# EAGLE schematic GPS_board_sch (EAGLE 8.6.0)
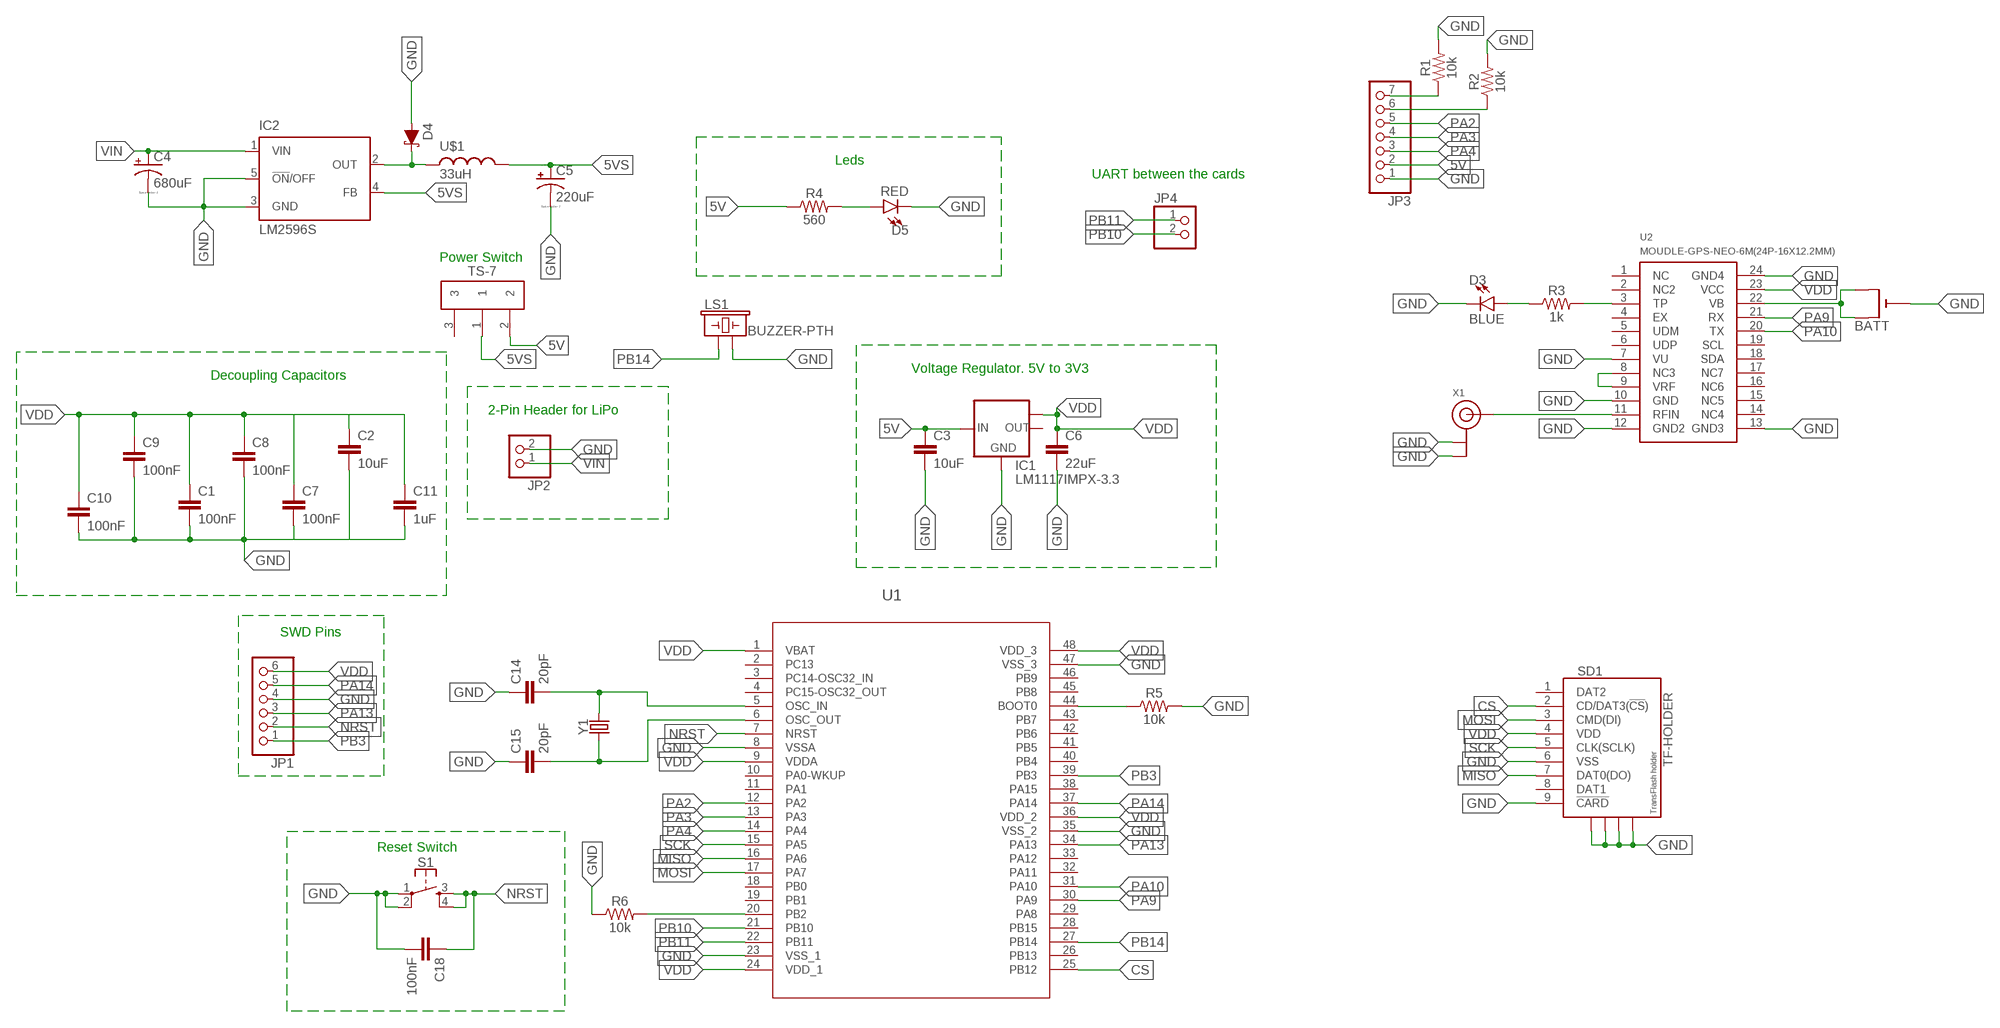
[diagram p0: schematic, sheet 1]

## Parts
BATT  CR1220SMT  [CR1220-SMD]
C1  100nF  10UF-0805-10V-10%  [0805]
C2  10uF  10UF-0805-10V-10%  [0805]
C3  10uF  10UF-0805-10V-10%  [0805]
C4  680uF  CPOL-USTT5D7  [TT5D7]
C5  220uF  CPOL-USTT5D7  [TT5D7]
C6  22uF  10UF-0805-10V-10%  [0805]
C7  100nF  10UF-0805-10V-10%  [0805]
C8  100nF  10UF-0805-10V-10%  [0805]
C9  100nF  10UF-0805-10V-10%  [0805]
C10  100nF  10UF-0805-10V-10%  [0805]
C11  1uF  10UF-0805-10V-10%  [0805]
C14  20pF  10UF-0805-10V-10%  [0805]
C15  20pF  10UF-0805-10V-10%  [0805]
C18  100nF  10UF-0805-10V-10%  [0805]
D3  BLUE  LED-BLUE1206  [LED-1206]
D4  3A/40V/500mV  DIODE-SCHOTTKY-B340A  [SMA-DIODE]
D5  RED  LED-RED1206  [LED-1206]
IC1  LM1117IMPX-3.3  [SOT223]
IC2  LM2596S  [TO263-5]
JP1  PINHD-1X6  [1X06]
JP2  PINHD-1X2  [1X02]
JP3  PINHD-1X7  [1X07]
JP4  PINHD-1X2/90  [1X02/90]
LS1  BUZZER-PTH  [BUZZER-12MM]
R1  10k  0.3OHM-0805-1/8W-1%  [0805]
R2  10k  0.3OHM-0805-1/8W-1%  [0805]
R3  1k  0.3OHM-0805-1/8W-1%  [0805]
R4  560  0.3OHM-0805-1/8W-1%  [0805]
R5  10k  0.3OHM-0805-1/8W-1%  [0805]
R6  10k  0.3OHM-0805-1/8W-1%  [0805]
S1  MOMENTARY-SWITCH-SPST-2-SMD-5.2MM  [TACTILE_SWITCH_SMD_5.2MM]
SD1  TF-HOLDER  [TF-PULL]
TS-7  TS-7  [TS7]
U1  STM32F103CXT2  [LQFP48-7X7MM]
U2  MOUDLE-GPS-NEO-6M(24P-16X12.2MM)  [GPS24P-SMD-1.1-16X12.2MM]
U$1  33uH  MSS1260  [MSS1260]
X1  ANTENNA_U.FL  [U.FL]
Y1  CRYSTALPTH-HC49US  [HC49US]

## Nets
5V: C3.1 IC1.3(IN) JP3.2 R4.1 TS-7.2
5VS: C5.+ IC2.4(FB) TS-7.1 U$1.P$1
CS: SD1.2(CD/DAT3(!CS!)) U1.25(PB12)
GND: BATT.- C1.2 C2.2 C3.2 C4.- C5.- C6.2 C7.2 C8.2 C9.2 C10.2 C11.2 C14.1 C15.1 C18.2 D3.C D4.A D5.C IC1.1(GND) IC2.3(GND) IC2.5(!ON!/OFF) JP1.4 JP2.2 JP3.1 LS1.- R1.2 R2.2 R5.2 R6.1 S1.1 S1.2 SD1.6(VSS) SD1.9(!CARD) SD1.S1 SD1.S2 SD1.S3 SD1.S4 U1.8(VSSA) U1.23(VSS_1) U1.35(VSS_2) U1.47(VSS_3) U2.7(VU) U2.10(GND) U2.12(GND2) U2.13(GND3) U2.24(GND4) X1.1(GND) X1.2(GND)
MISO: SD1.7(DAT0(DO)) U1.16(PA6)
MOSI: SD1.3(CMD(DI)) U1.17(PA7)
N$2: C14.2 U1.5(OSC_IN) Y1.2
N$3: C15.2 U1.6(OSC_OUT) Y1.1
N$7: BATT.+$1(+) BATT.+$2(+1) U2.22(VB)
N$8: U2.11(RFIN) X1.3(SIGNAL)
N$11: R5.1 U1.44(BOOT0)
N$12: R6.2 U1.20(PB2)
N$13: D4.C IC2.2(OUT) U$1.P$2
N$16: D5.A R4.2
N$18: U2.8(NC3) U2.9(VRF)
N$20: R3.2 U2.3(TP)
N$21: D3.A R3.1
N$22: JP3.7 R1.1
N$23: JP3.6 R2.1
NRST: C18.1 JP1.2 S1.3 S1.4 U1.7(NRST)
PA2: JP3.5 U1.12(PA2)
PA3: JP3.4 U1.13(PA3)
PA4: JP3.3 U1.14(PA4)
PA9: U1.30(PA9) U2.21(RX)
PA10: U1.31(PA10) U2.20(TX)
PA13: JP1.3 U1.34(PA13)
PA14: JP1.5 U1.37(PA14)
PB3: JP1.1 U1.39(PB3)
PB10: JP4.2 U1.21(PB10)
PB11: JP4.1 U1.22(PB11)
PB14: LS1.+ U1.27(PB14)
SCK: SD1.5(CLK(SCLK)) U1.15(PA5)
VDD: C1.1 C2.1 C6.1 C7.1 C8.1 C9.1 C10.1 C11.1 IC1.TAB(OUT1) JP1.6 SD1.4(VDD) U1.1(VBAT) U1.9(VDDA) U1.24(VDD_1) U1.36(VDD_2) U1.48(VDD_3) U2.23(VCC)
VIN: C4.+ IC2.1(VIN) JP2.1
Unconnected: IC1.2(OUT) SD1.1(DAT2) SD1.8(DAT1) TS-7.3 U1.2(PC13) U1.3(PC14-OSC32_IN) U1.4(PC15-OSC32_OUT) U1.10(PA0-WKUP) U1.11(PA1) U1.18(PB0) U1.19(PB1) U1.26(PB13) U1.28(PB15) U1.29(PA8) U1.32(PA11) U1.33(PA12) U1.38(PA15) U1.40(PB4) U1.41(PB5) U1.42(PB6) U1.43(PB7) U1.45(PB8) U1.46(PB9) U2.1(NC) U2.2(NC2) U2.4(EX) U2.5(UDM) U2.6(UDP) U2.14(NC4) U2.15(NC5) U2.16(NC6) U2.17(NC7) U2.18(SDA) U2.19(SCL)

## Notes on the sheet
- Leds
- UART between the cards
- Power Switch
- Voltage Regulator. 5V to 3V3
- Decoupling Capacitors
- 2-Pin Header for LiPo
- SWD Pins
- Reset Switch

## Library data of the parts
BATT = adafruit:CR1220: CR1216/CR1220/CR1225 12mm 3V lithium coin cell Great for battery packup. Both SMT and THM holders. Note the THM package has the ground pads on both sides of the PCB so that the masks are the same - this reduces the cost
C1 C6-C11 C14 C15 C18 = SparkFun-Capacitors:10UF: 10.0µF ceramic capacitors A capacitor is a passive two-terminal electrical component used to store electrical energy temporarily in an electric field.; PROD_ID: CAP-11330; VALUE: 10uF
C2 C3 = SparkFun-Capacitors:10UF: 10.0µF ceramic capacitors A capacitor is a passive two-terminal electrical component used to store electrical energy temporarily in an electric field.; PROD_ID: CAP-11330
C4 C5 = resistor:CPOL-US: POLARIZED CAPACITOR, American symbol
D3 = SparkFun-LED:LED-BLUE: Blue SMD LED Used in manufacturing of various products at SparkFun Packages: 0603 - SMD 0603 package [Product Link] <http://www.digikey.com/product-detail/en/SMLE12BC7TT86/511-1589-2-ND/1641808> 1206 - SMD1206 package [Product Link] <http://www.digikey.com/product-detail/en/lite-on-inc/LTST-C150TBKT/160-1643-1-ND/573584> SparkFun Products: ESP8266 Thing-Dev Board <https://www.sparkfun.com/products/13711> RedBoard <https://www.sparkfun.com/products/12757>; PROD_ID: DIO-09911
D4 = SparkFun-DiscreteSemi:DIODE-SCHOTTKY: Schottky diode A Schottky diode is a semiconductor diode which has a low forward voltage drop and a very fast switching action.; PROD_ID: DIO-09886
D5 = SparkFun-LED:LED-RED: Red SMD LED Used in manufacturing of most products at SparkFun Packages: 0603 - SMD 0603 package [Product Link] <http://docs.avagotech.com/docs/AV02-0551EN> 0603 SMART - SMD 0603 SMART package ( more efficient and expensive)[Product Link] <http://www.osram-os.com/Graphics/XPic2/00077099_0.pdf> 1206 - SMD1206 package [Product Link] <https://www.sparkfun.com/datasheets/DevTools/LilyPad/Q150OVS4.pdff> SparkFun Products: Pro Mini 328 -5V <https://www.sparkfun.com/products/821> RedBoard <https://www.sparkfun.com/products/12757> IOIO-OTG <https://www.sparkfun.com/products/13613>; PROD_ID: DIO-09912
IC1 = lm1117:LM1117IMPX-*
IC2 = national-semiconductor:LM2596: SIMPLE SWITCHER® Power Converter 150 kHz 3A Step-Down Voltage Regulator Source: http://www.national.com/ds/LM/LM2596.pdf; MF: NATIONAL SEMICONDUCTOR; MPN: LM2596S-ADJ/NOPB; OC_FARNELL: 9494367; OC_NEWARK: 41K3842
JP1 = pinhead:PINHD-1X6: PIN HEADER
JP2 JP4 = pinhead:PINHD-1X2: PIN HEADER
JP3 = pinhead:PINHD-1X7: PIN HEADER
LS1 = SparkFun-Electromechanical:BUZZER: Buzzer Small round buzzers that operate around the audible 2kHz range. You can use these as speakers to create simple music or user interfaces. Variant Overview: PTH - Mini Speaker - PC Mount 12mm 2.048kHz <https://www.sparkfun.com/products/7950> PTH_KIT - Mini Speaker - PC Mount 12mm 2.048kHz <https://www.sparkfun.com/products/7950> KIT simplifies soldering by adding stop mask to one side of the pads. PTH_NO_SILK - Mini Speaker - PC Mount 12mm 2.048kHz <https://www.sparkfun.com/products/7950> No silkscreen indicator of buzzer outline. PTH_KIT_NO_SILK - Mini Speaker - PC Mount 12mm 2.048kHz <https://www.sparkfun.com/products/7950> KIT package w/o silkscreen SMD - Buzzer Audio Magnetic (CCV-084B16) SMD buzzer used on, e.g. the LilyPad Buzzer <https://www.sparkfun.com/products/8463> and RFID USB Reader <https://www.sparkfun.com/products/9963>. SMD_KIT - Buzzer Audio Magnetic (CCV-084B16) SMD Buzzer with elongated pins to make soldering easier. Used on the SparkFun Simon Says - Surface Mount Soldering Kit <https://www.sparkfun.com/products/10935>.; PROD_ID: COMP-08253; SF_SKU: COM-07950
R1-R6 = SparkFun-Resistors:0.3OHM: 0.3Ω resistor A resistor is a passive two-terminal electrical component that implements electrical resistance as a circuit element. Resistors act to reduce current flow, and, at the same time, act to lower voltage levels within circuits. - Wikipedia; PROD_ID: RES-11622; VALUE: 0.3
S1 = SparkFun-Switches:MOMENTARY-SWITCH-SPST-2: Momentary Switch (Pushbutton) - SPST - Two Circuits Normally-open (NO) SPST momentary switches (buttons, pushbuttons). Schematic symbol includes two switch circuits. Variants SMD-4.6MMX2.8MM - 4.60mm x 2.80mm Tactile Momentary Button Switch - Used on SparkFun SAMD21 Mini Breakout <https://www.sparkfun.com/products/13664> SMD-5.2MM - Mini Pushbutton Switch - SMD <https://www.sparkfun.com/products/8720> - Used on Arduino Pro Mini <https://www.sparkfun.com/products/11114>; PROD_ID: SWCH-08247; SF_SKU: COM-08720
SD1 = sd-mmc:TF-HOLDER: TF / Micro SD socket is PUSH-PUSH type, the card can be pushed into and auto locked and pushed out by simply press the card. Surface Mounting type.
TS-7 = ts-7-switch:TS-7
U1 = stm32f103cxt2:STM32F103CXT2; MANUFACTURER_PART_NUMBER: stm32f103cxt2; VENDOR: STMicroelectronics
U2 = MOUDLE-GPS-NEO-6M_24P-16X12.2MM_:MOUDLE-GPS-NEO-6M(24P-16X12.2MM): 317050000; AVAILABILITY: Unavailable; DESCRIPTION: SMD GPS Module;; MF: u-blox; MP: NEO-6M-GPS; PACKAGE: None; PRICE: None
U$1 = inductor-coilcraft:MSS1260: SMT Power Inductor
X1 = adafruit:ANTENNA_U.FL: U.FL Antenna Connector
Y1 = SparkFun-Clocks:CRYSTAL: Crystals (Generic) These are passive quartz crystals, which can be used as a clock source for a microcontroller. Crystal's are two-terminal devices. They require external "load" capacitors to generate an oscillating signal.